# EAGLE design sfp-board (EAGLE 7.6.0)
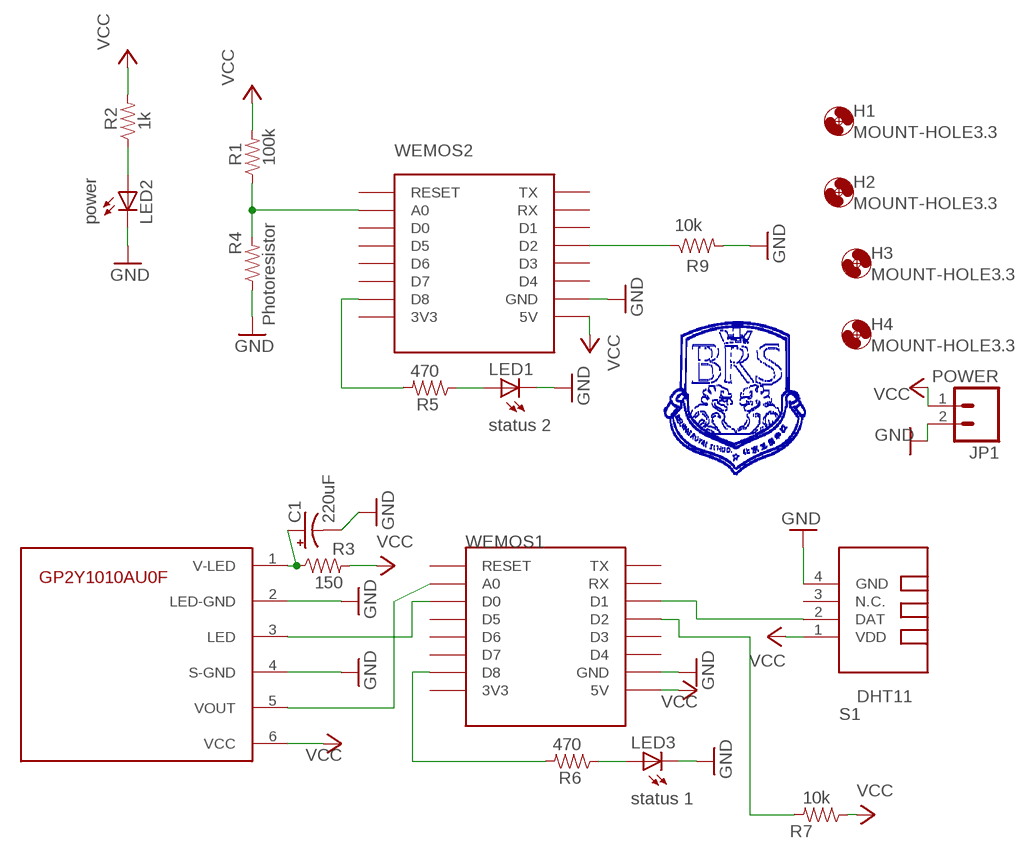
[diagram p0: schematic, sheet 1]

## Parts
C1  220uF  CAP_POLPTH1  [CPOL-RADIAL-100UF-25V]
GP2Y1010AU0F  GP2Y1010AU  [GP2Y1010AU]
H1  MOUNT-HOLE3.3  [3,3]
H2  MOUNT-HOLE3.3  [3,3]
H3  MOUNT-HOLE3.3  [3,3]
H4  MOUNT-HOLE3.3  [3,3]
JP1  POWER  M02PTH3  [1X02_LONGPADS]
LED1  status 2  LED5MM  [LED5MM]
LED2  power  LED5MM  [LED5MM]
LED3  status 1  LED5MM  [LED5MM]
R1  100k  RESISTOR0414/15  [0414/15]
R2  1k  RESISTOR0414/15  [0414/15]
R3  150  RESISTOR0414/15  [0414/15]
R4  Photoresistor  RESISTOR0414V  [0414V]
R5  470  RESISTOR0414/15  [0414/15]
R6  470  RESISTOR0414/15  [0414/15]
R7  10k  RESISTOR0414/15  [0414/15]
R9  10k  RESISTOR0414/15  [0414/15]
S1  DHT11  TEMP-HUM-SENSOR-DHT11  [TEMP-HUM-SENSOR-DHT11]
U$1  BRS-SYMBOL  [BRS]
WEMOS1  WEMOS-D1-MINI  [WEMOS-D1-MINI]
WEMOS2  WEMOS-D1-MINI  [WEMOS-D1-MINI]

## Nets
GND: C1.2(-) GP2Y1010AU0F.2(LED-GND) GP2Y1010AU0F.4(S-GND) JP1.2 LED1.K(C) LED2.K(C) LED3.K(C) R4.1 R9.2 S1.4(GND) WEMOS1.GND WEMOS2.GND
N$1: C1.1(+) GP2Y1010AU0F.1(V-LED) R3.1
N$2: R1.1 R4.2 WEMOS2.A0
N$3: GP2Y1010AU0F.3(LED) WEMOS1.D0
N$4: GP2Y1010AU0F.5(VOUT) WEMOS1.A0
N$5: LED2.A R2.1
N$6: LED1.A R5.1
N$7: S1.2(DAT) WEMOS1.D1
N$8: LED3.A R6.1
N$9: R6.2 WEMOS1.D8
N$10: R5.2 WEMOS2.D8
N$11: R9.1 WEMOS2.D2
N$12: R7.2 WEMOS1.D2
VCC: GP2Y1010AU0F.6(VCC) JP1.1 R1.2 R2.2 R3.2 R7.1 S1.1(VDD) WEMOS1.5V WEMOS2.5V
Unconnected: S1.3(N.C.) WEMOS1.3V3 WEMOS1.D3 WEMOS1.D4 WEMOS1.D5 WEMOS1.D6 WEMOS1.D7 WEMOS1.RESET WEMOS1.RX WEMOS1.TX WEMOS2.3V3 WEMOS2.D0 WEMOS2.D1 WEMOS2.D3 WEMOS2.D4 WEMOS2.D5 WEMOS2.D6 WEMOS2.D7 WEMOS2.RESET WEMOS2.RX WEMOS2.TX

## Library data of the parts
C1 = SparkFun:CAP_POL: Capacitor Polarized These are standard SMD and PTH capacitors. Normally 10uF, 47uF, and 100uF in electrolytic and tantalum varieties. Always verify the external diameter of the through hole cap, it varies with capacity, voltage, and manufacturer. The EIA devices should be standard.
GP2Y1010AU0F = gp2y1010au:GP2Y1010AU: GP2Y1010AU0F is a dust sensor by optical sensing system. An infrared emitting diode (IRED) and an phototransistor are diagonally arranged into this device. It detects the reflected light of dust in air. Especially, it is effective to detect very fine particle like the cigarette smoke. In addition it can distinguish smoke from house dust by pulse pattern of output voltage. 1. Compact, thin package (46.0 × 30.0 × 17.6 mm) 2. Low consumption current (Icc: MAX. 20 mA) 3. The presence of dust can be detected by the photometry of only one pulse
H1-H4 = holes:MOUNT-HOLE: MOUNTING HOLE with drill center marker
JP1 = SparkFun:M02: Header 2 Standard 2-pin 0.1" header. Use with straight break away headers (SKU : PRT-00116), right angle break away headers (PRT-00553), swiss pins (PRT-00743), machine pins (PRT-00117), and female headers (PRT-00115). Molex polarized connector foot print use with SKU : PRT-08233 with associated crimp pins and housings.
LED1-LED3 = digital-toy:LED: LEDs Standard schematic elements and footprints for 5mm, 3mm, 1206, and 0603 sized LEDs. 5mm - Spark Fun Electronics SKU : COM-00529 (and others) copy led.lbr 0805 led here, by hyl digital-toy. 2010.6.29
R1-R7 R9 = digital-toy:RESISTOR: Resistor Basic schematic elements and footprints for 0603, 1206, and PTH 1/10th watt (small) resistors. digital-toy copy vertical mount of axial-0.3 from rcl.lbr : the 0207/xx 3W resistor: 0617/17, 0617/22, 0617V
S1 = diy-modules:TEMP-HUM-SENSOR-DHT11: DHT11 - digital humidity & temperature sensor DHT11 datasheet available here: https://akizukidenshi.com/download/ds/aosong/DHT11.pdf Click here to find device on ebay.com <http://www.ebay.com/sch/dht11+digital+sensor>
U$1 = digital-toy:BRS-SYMBOL
WEMOS1 WEMOS2 = esp8266modules:WEMOS-D1-MINI: WeMos.cc D1 mini ESP8266 module

## Board
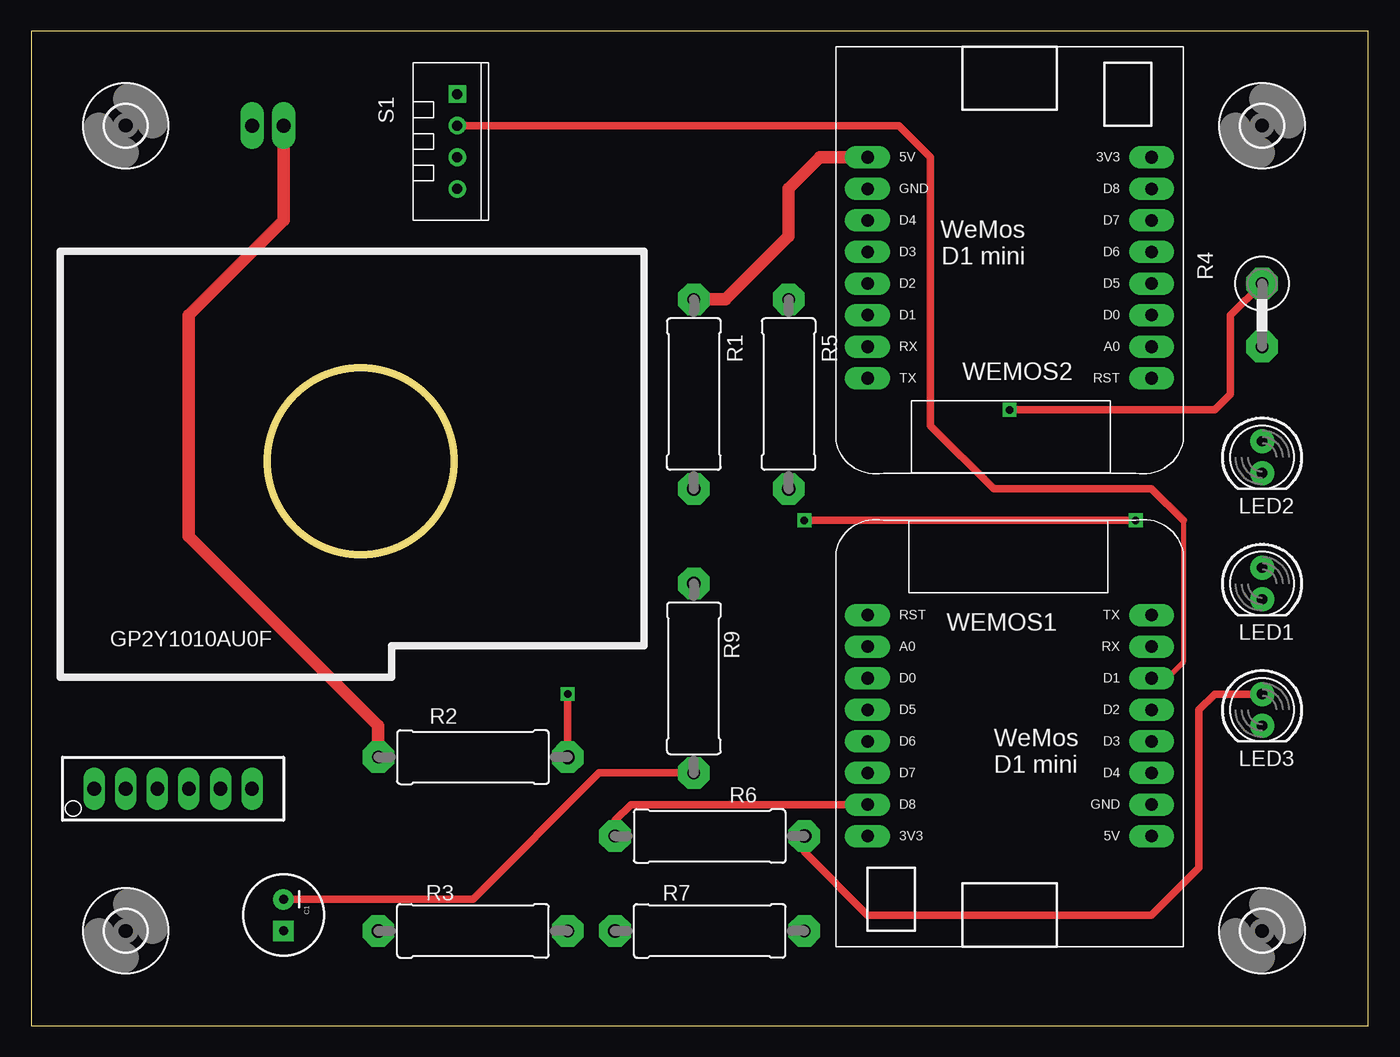
[diagram p1: board, top side]
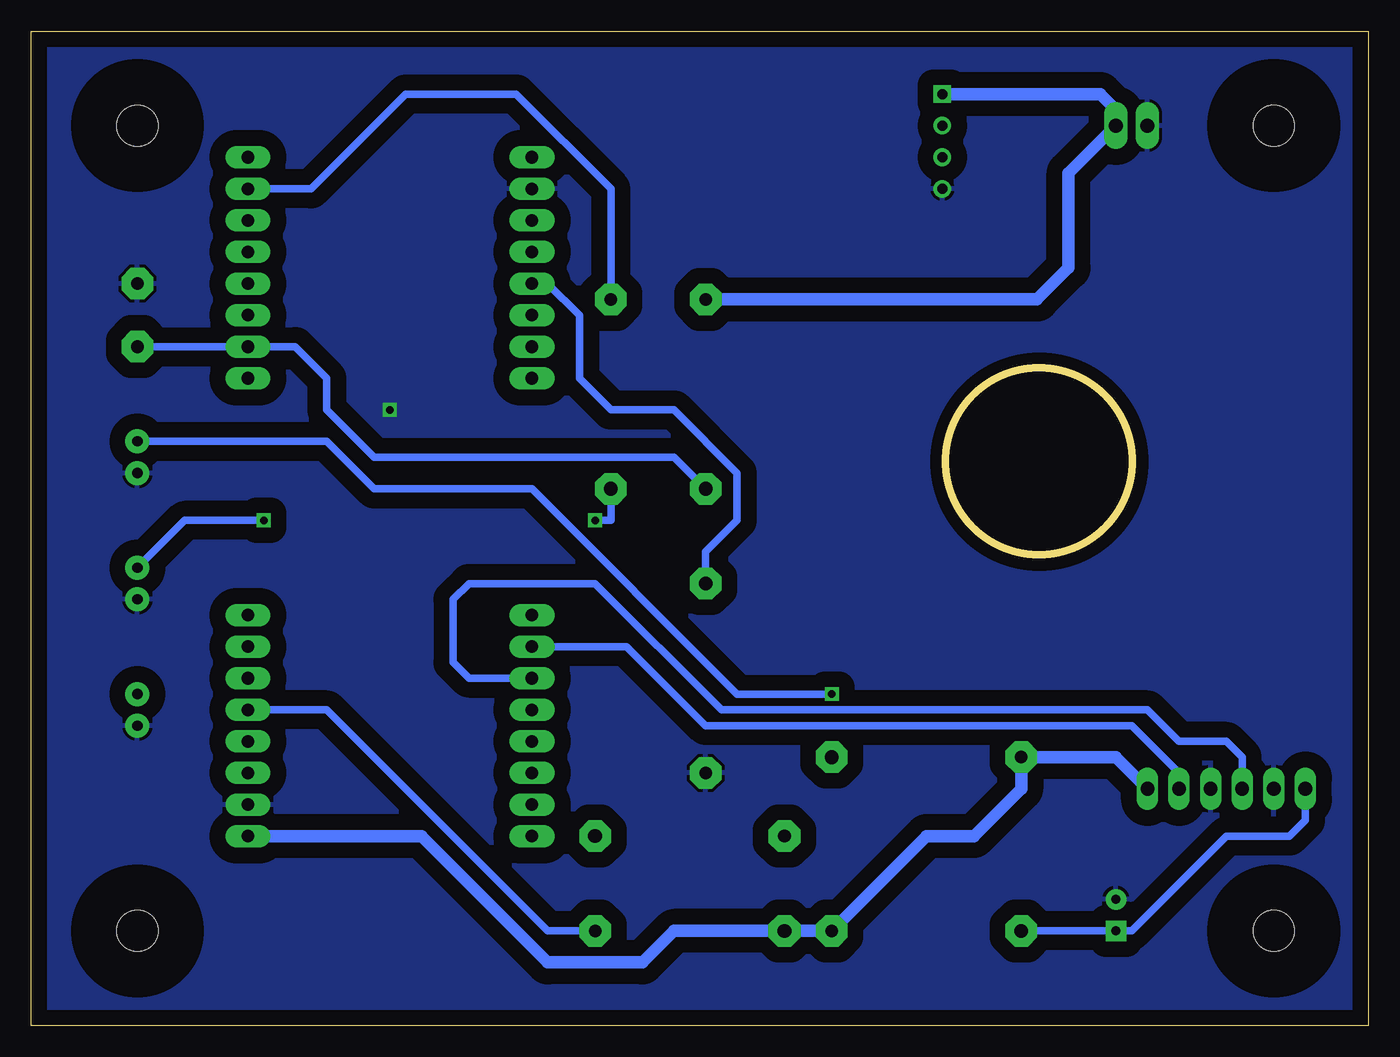
[diagram p2: board, bottom side, seen from below]

Size 107.62 x 80 mm. Coordinates in mm from the lower left corner, seen from the top.
Outline: 0,0 107.62,0 107.62,80 0,80 0,0
Copper layers (1*16): Top 0.035mm / dielectric 1.5mm / Bottom 0.035mm
Design rules "SparkFun": minimum track width 8mil, minimum drill 20mil, track to track 8mil, track to pad 8mil, pad to pad 8mil, via to via 8mil, smd to smd 8mil, copper to edge 10mil, drill to drill 8mil, minimum pad ring 12mil, minimum via ring 10mil, stop-mask expansion 4mil, vias tented up to drill 25mil, thermal gap 10mil

### Footprints (pad centres in the part's own frame; a part is rotated, then mirrored left to right if it is on the bottom)
CPOL-RADIAL-100UF-25V = drill 0.7 pad 1.651 square: 1 1.27,0 | drill 0.7 pad 1.651: 2 -1.27,0
GP2Y1010AU = drill 1.1 long: 1 -27.94,5.08; 2 -25.4,5.08; 3 -22.86,5.08; 4 -20.32,5.08; 5 -17.78,5.08; 6 -15.24,5.08 | hole 15: -6.545,31.398
3,3 = hole 3.3: 0,0
1X02_LONGPADS = drill 1.118 pad 1.88 long: 1 0,0; 2 2.54,0
LED5MM = drill 0.813 pad 1.93: A -1.27,0; K 1.27,0
0414/15 = drill 1.1 pad 2.54 octagon: 1 -7.62,0 | drill 1.016 pad 2.54 octagon: 2 7.62,0
0414V = drill 1.016 pad 2.54 octagon: 1 -2.54,0; 2 2.54,0
TEMP-HUM-SENSOR-DHT11 = drill 0.8 square: 1 -3.81,0 | drill 0.8: 2 -1.27,0; 3 1.27,0; 4 3.81,0
WEMOS-D1-MINI = drill 1.016 pad 1.829 long: 3V3 -10.16,-10.16; 5V 12.7,-10.16; A0 -10.16,5.08; D0 -10.16,2.54; D1 12.7,2.54; D2 12.7,0; D3 12.7,-2.54; D4 12.7,-5.08; D5 -10.16,0; D6 -10.16,-2.54; D7 -10.16,-5.08; D8 -10.16,-7.62; GND 12.7,-7.62; RESET -10.16,7.62; RX 12.7,5.08; TX 12.7,7.62

### Placement (x,y rotation side)
C1  20.32,8.89 270 top
GP2Y1010AU0F  33.02,13.97 0 top
H1  7.62,72.39 0 top
H2  99.06,72.39 0 top
H3  99.06,7.62 0 top
H4  7.62,7.62 0 top
JP1  20.32,72.39 180 top
LED1  99.06,35.56 270 top
LED2  99.06,45.72 270 top
LED3  99.06,25.4 270 top
R1  53.34,50.8 90 top
R2  35.56,21.59 180 top
R3  35.56,7.62 0 top
R4  99.06,57.15 270 top
R5  60.96,50.8 90 top
R6  54.61,15.24 180 top
R7  54.61,7.62 0 top
R9  53.34,27.94 270 top
S1  34.29,71.12 270 top
U$1  38.1,57.15 0 top
WEMOS1  77.47,25.4 0 top
WEMOS2  80.01,59.69 180 top

### Tracks (layer width: path | path; a pad name or v marks a point on that pad's centre or on a via)
GND  (via drill 0.6)
  Top 0.61: C1.2 35.56,10.16 45.72,20.32 R9.2 | R4.1 96.52,57.15 96.52,50.8 95.25,49.53 v78.74,49.53
  pour Bottom (isolate 1.27): 0,80.01 0,0 107.95,0 107.95,80.01
N$1
  Bottom 0.61: GP2Y1010AU0F.1 5.08,16.51 6.35,15.24 11.43,15.24 19.05,7.62 C1.1 R3.1
N$2
  Bottom 0.61: R4.2 WEMOS2.A0 86.36,54.61 83.82,52.07 83.82,49.53 80.01,45.72 55.88,45.72 R1.1
N$3
  Bottom 0.61: GP2Y1010AU0F.3 10.16,21.59 11.43,22.86 15.24,22.86 17.78,25.4 52.07,25.4 62.23,35.56 72.39,35.56 73.66,34.29 73.66,29.21 72.39,27.94 WEMOS1.D0
N$4
  Bottom 0.61: GP2Y1010AU0F.5 15.24,20.32 19.05,24.13 53.34,24.13 59.69,30.48 WEMOS1.A0
N$5  (via drill 0.6)
  Top 0.61: v43.18,26.67 R2.1
  Bottom 0.61: LED2.A 83.82,46.99 80.01,43.18 67.31,43.18 50.8,26.67 v43.18,26.67
N$6  (via drill 0.6)
  Top 0.61: v62.23,40.64 v88.9,40.64
  Bottom 0.61: R5.1 60.96,40.64 v62.23,40.64 | v88.9,40.64 95.25,40.64 LED1.A
N$7
  Top 0.406: 92.71,40.64 92.71,29.21 91.44,27.94 WEMOS1.D1
  Top 0.61: S1.2 69.85,72.39 72.39,69.85 72.39,48.26 77.47,43.18 90.17,43.18 92.71,40.64
N$8
  Top 0.61: R6.1 62.23,13.97 67.31,8.89 90.17,8.89 93.98,12.7 93.98,25.4 95.25,26.67 LED3.A
N$9
  Top 0.61: R6.2 46.99,16.51 48.26,17.78 WEMOS1.D8
N$10
  Bottom 0.61: R5.2 60.96,67.31 68.58,74.93 77.47,74.93 85.09,67.31 WEMOS2.D8
N$11
  Bottom 0.406: WEMOS2.D2 66.04,59.69
  Bottom 0.61: 66.04,59.69 63.5,57.15 63.5,52.07 60.96,49.53 55.88,49.53 50.8,44.45 50.8,40.64 53.34,38.1 R9.1
N$12
  Bottom 0.61: R7.2 66.04,7.62 83.82,25.4 WEMOS1.D2
VCC
  Top 1.016: JP1.1 20.32,64.77 12.7,57.15 12.7,39.37 27.94,24.13 R2.2 | WEMOS2.5V 63.5,69.85 60.96,67.31 60.96,63.5 55.88,58.42 R1.2
  Bottom 0.406: R7.1 48.26,7.62 | 20.32,73.66 JP1.1
  Bottom 1.016: S1.1 21.59,74.93 20.32,73.66 | GP2Y1010AU0F.6 20.32,21.59 R2.2 27.94,19.05 31.75,15.24 35.56,15.24 R3.2 R7.1 55.88,7.62 58.42,5.08 66.04,5.08 76.2,15.24 WEMOS1.5V | R1.2 26.67,58.42 24.13,60.96 24.13,68.58 JP1.1

### Text on the board
tDocu: SFP-1902-V1.0